# Altium project Coil_Driver.PrjPcb (part 2 of 3)

## Sheet SensorInAmp.SchDoc
size A3
Used 8 times, as channels IA1, IA2, IA3, IA4, IA5, IA6, IA7, IA8. Parts and nets are listed once, with the designators drawn on the sheet.
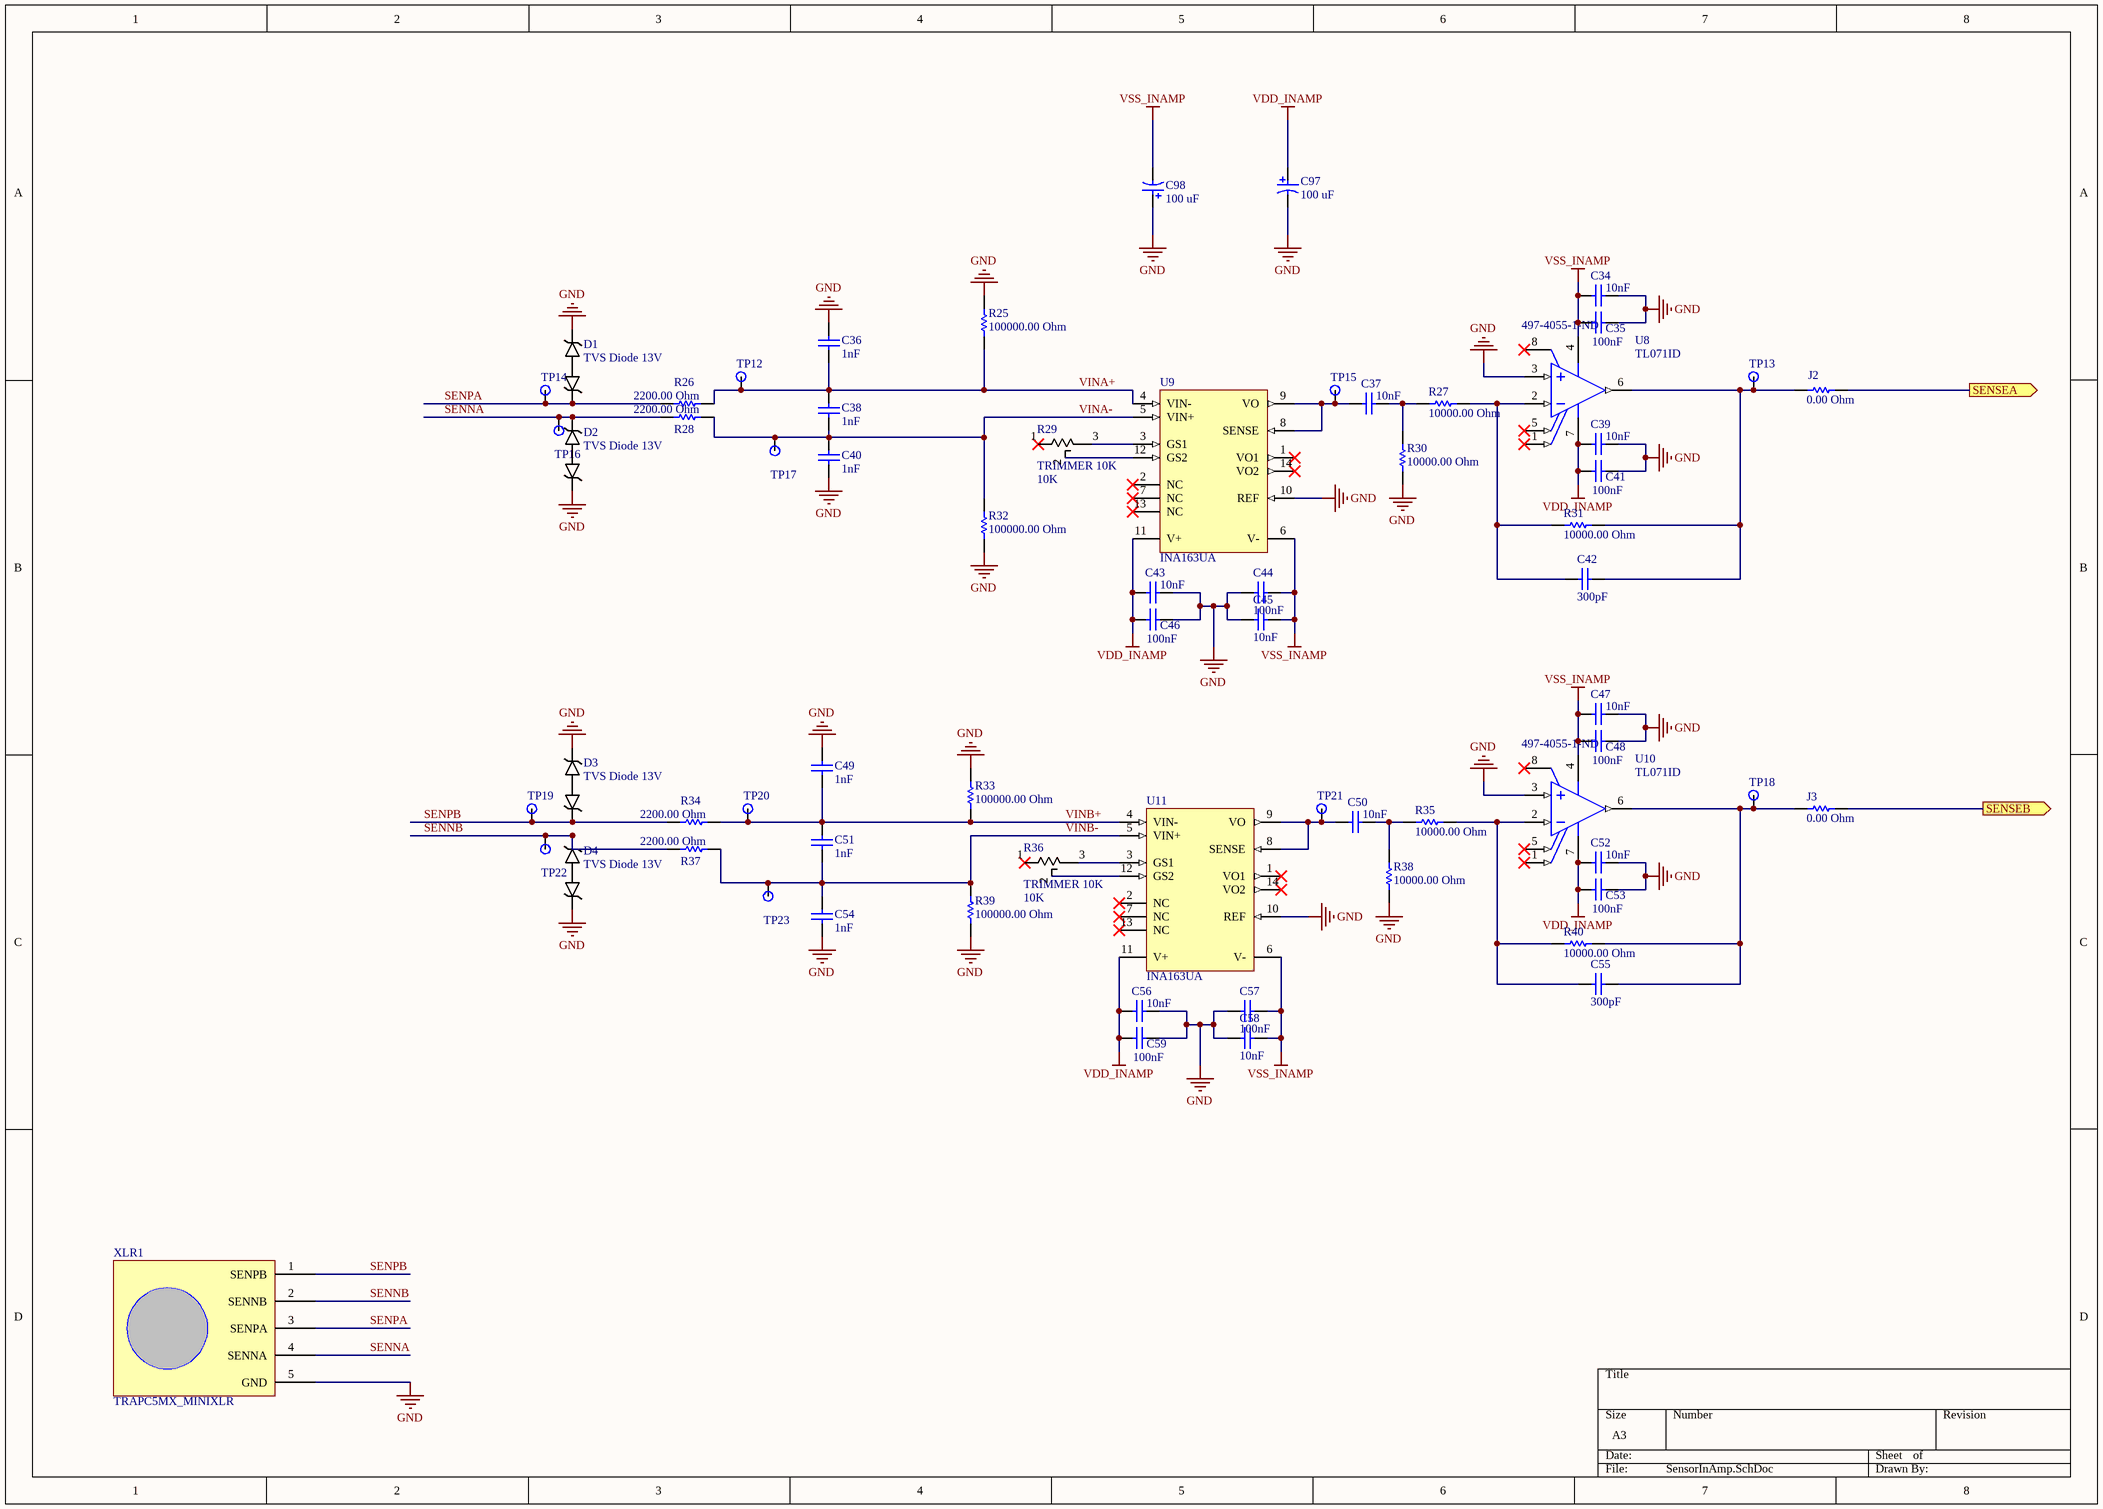
[diagram p4: SensorInAmp.SchDoc]

### Parts
C34  value 10nF  [CAPC0603(1608)100_N]  (hidden comment: CAP 10nF 25V 0603(1608))
C35  value 100nF  [CAPC0603(1608)100_M]  (hidden comment: CAP 100nF 25V 0603(1608))
C36  value 1nF  [CAPC0603(1608)100_M]  (hidden comment: CAP 1nF 25V 0603(1608))
C37  value 10nF  [CAPC0603(1608)100_N]  (hidden comment: CAP 10nF 25V 0603(1608))
C38  value 1nF  [CAPC0603(1608)100_M]  (hidden comment: CAP 1nF 25V 0603(1608))
C39  value 10nF  [CAPC0603(1608)100_N]  (hidden comment: CAP 10nF 25V 0603(1608))
C40  value 1nF  [CAPC0603(1608)100_M]  (hidden comment: CAP 1nF 25V 0603(1608))
C41  value 100nF  [CAPC0603(1608)100_M]  (hidden comment: CAP 100nF 25V 0603(1608))
C42  value 300pF  [CAPC0603(1608)100_N]  (hidden comment: CAP 300pF 25V 0603(1608))
C43  value 10nF  [CAPC0603(1608)100_N]  (hidden comment: CAP 10nF 25V 0603(1608))
C44  value 100nF  [CAPC0603(1608)100_M]  (hidden comment: CAP 100nF 25V 0603(1608))
C45  value 10nF  [CAPC0603(1608)100_N]  (hidden comment: CAP 10nF 25V 0603(1608))
C46  value 100nF  [CAPC0603(1608)100_M]  (hidden comment: CAP 100nF 25V 0603(1608))
C47  value 10nF  [CAPC0603(1608)100_N]  (hidden comment: CAP 10nF 25V 0603(1608))
C48  value 100nF  [CAPC0603(1608)100_M]  (hidden comment: CAP 100nF 25V 0603(1608))
C49  value 1nF  [CAPC0603(1608)100_M]  (hidden comment: CAP 1nF 25V 0603(1608))
C50  value 10nF  [CAPC0603(1608)100_N]  (hidden comment: CAP 10nF 25V 0603(1608))
C51  value 1nF  [CAPC0603(1608)100_M]  (hidden comment: CAP 1nF 25V 0603(1608))
C52  value 10nF  [CAPC0603(1608)100_N]  (hidden comment: CAP 10nF 25V 0603(1608))
C53  value 100nF  [CAPC0603(1608)100_M]  (hidden comment: CAP 100nF 25V 0603(1608))
C54  value 1nF  [CAPC0603(1608)100_M]  (hidden comment: CAP 1nF 25V 0603(1608))
C55  value 300pF  [CAPC0603(1608)100_N]  (hidden comment: CAP 300pF 25V 0603(1608))
C56  value 10nF  [CAPC0603(1608)100_N]  (hidden comment: CAP 10nF 25V 0603(1608))
C57  value 100nF  [CAPC0603(1608)100_M]  (hidden comment: CAP 100nF 25V 0603(1608))
C58  value 10nF  [CAPC0603(1608)100_N]  (hidden comment: CAP 10nF 25V 0603(1608))
C59  value 100nF  [CAPC0603(1608)100_M]  (hidden comment: CAP 100nF 25V 0603(1608))
C97  100 uF  [CAPPR55-250-1120X630X1220]
C98  100 uF  [CAPPR55-250-1120X630X1220]
D1  TVS Diode 13V  [CPDUR5V0R-HF]
D2  TVS Diode 13V  [CPDUR5V0R-HF]
D3  TVS Diode 13V  [CPDUR5V0R-HF]
D4  TVS Diode 13V  [CPDUR5V0R-HF]
J2  0.00 Ohm  [RESC1206(3216)_M]
J3  0.00 Ohm  [RESC1206(3216)_M]
R25  value 100000.00 Ohm  [RESC0603(1608)_N]  (hidden comment: 100K 5% 0603(1608))
R26  value 2200.00 Ohm  [RESC0603(1608)_L]  (hidden comment: 2K2 1% 0603(1608))
R27  value 10000.00 Ohm  [RESC0603(1608)_N]  (hidden comment: 10K 5% 0603(1608))
R28  value 2200.00 Ohm  [RESC0603(1608)_L]  (hidden comment: 2K2 1% 0603(1608))
R29  TRIMMER 10K  value 10K  [TRIMMER 10K]
R30  value 10000.00 Ohm  [RESC0603(1608)_N]  (hidden comment: 10K 5% 0603(1608))
R31  value 10000.00 Ohm  [RESC0603(1608)_N]  (hidden comment: 10K 5% 0603(1608))
R32  value 100000.00 Ohm  [RESC0603(1608)_N]  (hidden comment: 100K 5% 0603(1608))
R33  value 100000.00 Ohm  [RESC0603(1608)_N]  (hidden comment: 100K 5% 0603(1608))
R34  value 2200.00 Ohm  [RESC0603(1608)_L]  (hidden comment: 2K2 1% 0603(1608))
R35  value 10000.00 Ohm  [RESC0603(1608)_N]  (hidden comment: 10K 5% 0603(1608))
R36  TRIMMER 10K  value 10K  [TRIMMER 10K]
R37  value 2200.00 Ohm  [RESC0603(1608)_L]  (hidden comment: 2K2 1% 0603(1608))
R38  value 10000.00 Ohm  [RESC0603(1608)_N]  (hidden comment: 10K 5% 0603(1608))
R39  value 100000.00 Ohm  [RESC0603(1608)_N]  (hidden comment: 100K 5% 0603(1608))
R40  value 10000.00 Ohm  [RESC0603(1608)_N]  (hidden comment: 10K 5% 0603(1608))
TP12  Testpoint  [0603 PROBE PAD]  (value not drawn)
TP13  Testpoint  [0603 PROBE PAD]  (value not drawn)
TP14  Testpoint  [0603 PROBE PAD]  (value not drawn)
TP15  Testpoint  [0603 PROBE PAD]  (value not drawn)
TP16  Testpoint  [0603 PROBE PAD]  (value not drawn)
TP17  Testpoint  [0603 PROBE PAD]  (value not drawn)
TP18  Testpoint  [0603 PROBE PAD]  (value not drawn)
TP19  Testpoint  [0603 PROBE PAD]  (value not drawn)
TP20  Testpoint  [0603 PROBE PAD]  (value not drawn)
TP21  Testpoint  [0603 PROBE PAD]  (value not drawn)
TP22  Testpoint  [0603 PROBE PAD]  (value not drawn)
TP23  Testpoint  [0603 PROBE PAD]  (value not drawn)
U8  TL071ID  Supplier Part Number 1: 497-4055-1-ND  [D0008A_L]
U9  INA163UA  [D0014A_L]
U10  TL071ID  Supplier Part Number 1: 497-4055-1-ND  [D0008A_L]
U11  INA163UA  [D0014A_L]
XLR1  TRAPC5MX_MINIXLR  [MiniXLR_TRAPC5MX_5POS]

### Ports
SENSEA (out), SENSEB (out)

### Nets
GND: C34.2 C35.1 C36.2 C39.2 C40.1 C41.1 C43.2 C44.1 C45.2 C46.1 C47.2 C48.1 C49.2 C52.2 C53.1 C54.1 C56.2 C57.1 C58.2 C59.1 C97.2 C98.1 D1.2 D2.1 D3.2 D4.1 R25.1 R30.2 R32.2 R33.1 R38.2 R39.2 U8.3(IN+) U9.10(REF) U10.3(IN+) U11.10(REF) XLR1.5(GND)
VDD_INAMP: C39.1 C41.2 C43.1 C46.2 C52.1 C53.2 C56.1 C59.2 C97.1 U8.7(VCC+) U9.11(V+) U10.7(VCC+) U11.11(V+)
VSS_INAMP: C34.1 C35.2 C44.2 C45.1 C47.1 C48.2 C57.2 C58.1 C98.2 U8.4(VCC-) U9.6(V-) U10.4(VCC-) U11.6(V-)
SENNA: D2.2 R28.2 TP16.0 XLR1.4(SENNA)
SENNB: D4.2 R37.2 TP22.0 XLR1.2(SENNB)
SENPA: D1.1 R26.2 TP14.0 XLR1.3(SENPA)
SENPB: D3.1 R34.2 TP19.0 XLR1.1(SENPB)
SENSEA: J2.2 ; port SENSEA
SENSEB: J3.2 ; port SENSEB
VINA+: C36.1 C38.2 R25.2 R26.1 TP12.0 U9.4(VIN-)
VINA-: C38.1 C40.2 R28.1 R32.1 TP17.0 U9.5(VIN+)
VINB+: C49.1 C51.2 R33.2 R34.1 TP20.0 U11.4(VIN-)
VINB-: C51.1 C54.2 R37.1 R39.1 TP23.0 U11.5(VIN+)
NetC37_1: C37.1 TP15.0 U9.8(SENSE) U9.9(VO)
NetC37_2: C37.2 R27.2 R30.1
NetC42_1: C42.1 J2.1 R31.1 TP13.0 U8.6(OUT)
NetC42_2: C42.2 R27.1 R31.2 U8.2(IN-)
NetC50_1: C50.1 TP21.0 U11.8(SENSE) U11.9(VO)
NetC50_2: C50.2 R35.2 R38.1
NetC55_1: C55.1 J3.1 R40.1 TP18.0 U10.6(OUT)
NetC55_2: C55.2 R35.1 R40.2 U10.2(IN-)
NetR29_2: R29.2 U9.12(GS2)
NetR29_3: R29.3 U9.3(GS1)
NetR36_2: R36.2 U11.12(GS2)
NetR36_3: R36.3 U11.3(GS1)

Not connected (* = marked no-connect by the designer): R29 1*; R36 1*; U8 1(OFFSET_N1)* 5(OFFSET_N2)* 8(NC)*; U9 1(VO1)* 2(NC)* 7(NC)* 13(NC)* 14(VO2)*; U10 1(OFFSET_N1)* 5(OFFSET_N2)* 8(NC)*; U11 1(VO1)* 2(NC)* 7(NC)* 13(NC)* 14(VO2)*

### Channels
IA1: designators end in _IA1; ports SENSEA=SENSEA1 SENSEB=SENSEB1
IA2: designators end in _IA2; ports SENSEA=SENSEA2 SENSEB=SENSEB2
IA3: designators end in _IA3; ports SENSEA=SENSEA3 SENSEB=SENSEB3
IA4: designators end in _IA4; ports SENSEA=SENSEA4 SENSEB=SENSEB4
IA5: designators end in _IA5; ports SENSEA=SENSEA5 SENSEB=SENSEB5
IA6: designators end in _IA6; ports SENSEA=SENSEA6 SENSEB=SENSEB6
IA7: designators end in _IA7; ports SENSEA=SENSEA7 SENSEB=SENSEB7
IA8: designators end in _IA8; ports SENSEA=SENSEA8 SENSEB=SENSEB8

### Library data of the parts
C34 C37 C39 C43 C45 C47 C50 C52 C56 C58 = CMP-1035-02317-1: CAP 10nF 25V ±10% 0603 (1608 Metric) Thickness 1mm SMD; Tolerance: Â±10%; Case-Metric: 1608; Case-EIA: 0603; Max Thickness: 1 mm; Rated Voltage: 25 V; Technology: SMT; OrderURL: http://www.digikey.ie/product-detail/en/yageo/CC0603KRX7R8BB103/311-1360-1-ND/2103144; Supplier 1: Digi-Key; Supplier Part Number: 311-1360-1-ND; Supplier Part Number 1: 311-1360-1-ND
C35 C41 C44 C46 C48 C53 C57 C59 = CMP-1035-02588-1: CAP 100nF 25V ±10% 0603 (1608 Metric) Thickness 1mm SMD; Case-Metric: 1608; Case-EIA: 0603; Tolerance: Â±10%; Max Thickness: 1 mm; Technology: SMT; Rated Voltage: 25 V; OrderURL: http://www.digikey.ie/product-detail/en/yageo/CC0603KRX7R8BB104/311-1341-1-ND/2103125; Supplier 1: Digi-Key; Supplier Part Number 1: 311-1341-1-ND
C36 C38 C40 C49 C51 C54 = CMP-1035-01883-1: CAP 1nF 25V ±5% 0603 (1608 Metric) Thickness 1mm SMD; Case-EIA: 0603; Tolerance: Â±5%; Case-Metric: 1608; Technology: SMT; Rated Voltage: 25 V; Max Thickness: 1 mm
C42 C55 = CMP-1035-01546-1: CAP 300pF 25V ±10% 0603 (1608 Metric) Thickness 1mm SMD; Tolerance: Â±10%; Case-EIA: 0603; Case-Metric: 1608; Rated Voltage: 25 V; Technology: SMT; Max Thickness: 1 mm
C97 C98 = CMP-1665-00015-4: Aluminum Electrolytic Capacitor (Radial Lead Type), 100 uF, 35 V, -40 to 85 degC, 2-Pin THD, RoHS, Bulk; Manufacturer: Panasonic; Voltage Rating: 35 V; PackageReference: Radial; ComponentLink2URL: http://industrial.panasonic.com/cdbs/www-data/pdf/RDF0000/ABA0000C1047.pdf; DatasheetVersion: 03/2016; REACH SVHC: No SVHC; Mounting Technology: Through Hole; ComponentLink2Description: Datasheet; Packaging: Bulk; Lead Pitch: 2.5 mm; Height: 11.2 mm; Pins: 2; RoHSCompliant: true; Mount: Through Hole; Package Quantity: 200; Min Operating Temperature: -40 degC; Max Operating Temperature: 85 degC; PackageDescription: 2-Pin Through Hole Device, Dia 6.3 mm, Body Length 11.2 mm; ComponentLink1Description: Manufacturer URL; Length: 11.2 mm; ComponentLink1URL: http://www.panasonic.com/
D1-D4 = CPDUR5V0R-HF: TVS DIODE 5VWM 13VC SOD-523F; Manufacturer: Comchip Technology; Type: Zener; Voltage - Reverse Standoff (Typ): 5V (Max); Voltage - Breakdown (Min): 5.6V; Current - Peak Pulse (10/1000µs): 12A (8/20µs); Power Line Protection: No; Capacitance @ Frequency: 20pF @ 1MHz; Value: 1K; Published: 8-Jun-2000; LatestRevisionDate: 29-May-2009; LatestRevisionNote: IPC-7351 Footprint Added.; PackageReference: J1-0603; Publisher: Altium Limited; PackageDescription: Chip Resistor; Manufacturer Part Number: CPDUR5V0R-HF; RoHS: RoHS Compliant; Category: Circuit Protection; Packaging: Cut Tape (CT); Part Status: Active; Voltage - Clamping (Max) @ Ipp: 13V; Power - Peak Pulse: -; Applications: General Purpose; Operating Temperature: -40°C ~ 150°C (TJ); Mounting Type: Surface Mount; Package / Case: SC-79, SOD-523; Supplier Device Package: 0603/SOD-523F; ComponentLink1URL: http://www.comchiptech.com/cms/UserFiles/CPDUR5V0R-HF-Rev%20B339379.pdf; ComponentLink1Description: http://www.comchiptech.com/cms/UserFiles/CPDUR5V0R-HF-Rev%20B339379.pdf; Supplier 1: Digi-Key; Supplier Part Number 1: 641-1526-1-ND; Stock 1: 6593; Pricing 1: 1=0.38, 10=0.271, 25=0.2112, 100=0.1597, 250=0.113, 500=0.09044, 1000=0.06933 (EUR)
J2 J3 = CMP-1014-00001-1: Jumper 1206 (3216 Metric); Tolerance: None; Case-EIA: 1206; Case-Metric: 3216; Technology: SMT; Power: None; Value: 0.00 Ohm; OrderURL: http://www.digikey.ie/product-detail/en/yageo/RC0603JR-070RL/311-0.0GRCT-ND/729622; Supplier 1: Digi-Key; Supplier Part Number 1: 311-0.0GRCT-ND
R25 R32 R33 R39 = CMP-1012-00122-1: 100K 0.1W 5% 0603 (1608 Metric)  SMD; Case-EIA: 0603; Case-Metric: 1608; Tolerance: 5 %; Power: 0.1 W; Technology: SMT; OrderURL: http://www.digikey.ie/product-detail/en/yageo/RC0603JR-07100KL/311-100KGRCT-ND/729645; Supplier Part Number 1: 311-100KGRCT-ND; Supplier 1: Digi-Key
R26 R28 R34 R37 = CMP-1012-00546-1: 2K2 0.1W 1% 0603 (1608 Metric)  SMD; Case-EIA: 0603; Case-Metric: 1608; Tolerance: 1 %; Power: 0.1 W; Technology: SMT
R27 R30 R31 R35 R38 R40 = CMP-1012-00098-1: 10K 0.1W 5% 0603 (1608 Metric)  SMD; Case-EIA: 0603; Case-Metric: 1608; Technology: SMT; Tolerance: 5 %; Power: 0.1 W; OrderURL: http://www.digikey.ie/product-detail/en/yageo/RC0603JR-0710KL/311-10KGRCT-ND/729647; Supplier 1: Digi-Key; Supplier Part Number 1: 311-10KGRCT-ND
R29 R36 = TRIMMER 10K: TRIMMER 10K OHM 0.5W TH; Manufacturer: TE Connectivity Passive Product; Manufacturer Part Number: 1-1623849-0; Power (Watts): 0.5W, 1/2W; Tolerance: ±10%; Temperature Coefficient: ±100ppm/°C; Number of Turns: 25; Adjustment Type: Top Adjustment; Resistive Material: Cermet; Published: 8-Jun-2000; LatestRevisionDate: 29-May-2009; LatestRevisionNote: IPC-7351 Footprint Added.; PackageReference: J1-0603; Publisher: Altium Limited; PackageDescription: Chip Resistor; RoHS: RoHS Compliant; Category: Potentiometers, Variable Resistors; Packaging: Bulk; Part Status: Active; Resistance (Ohms): 10k; Mounting Type: Through Hole; Termination Style: PC Pins; Size / Dimension: Rectangular - 0.374" x 0.185" Face x 0.394" H (9.50mm x 4.70mm x 10.00mm); ComponentLink1URL: http://www.te.com/commerce/DocumentDelivery/DDEController?Action=srchrtrv&DocNm=1623849&DocType=Customer+Drawing&DocLang=English; ComponentLink1Description: http://www.te.com/commerce/DocumentDelivery/DDEController?Action=srchrtrv&DocNm=1623849&DocType=Customer+Drawing&DocLang=English; Supplier 1: Digi-Key; Supplier Part Number 1: A105870-ND; Stock 1: 5809; Pricing 1: 1=0.89, 10=0.786, 25=0.7076, 50=0.6816, 100=0.6554, 250=0.61608, 500=0.5243, 1000=0.48499, 5000=0.39848 (EUR)
TP12-TP23 = Testpoint: 0.063" x 0.031" x 0.045" (1.60mm x 0.80mm x 1.15mm); OrderURL: http://www.digikey.ie/product-detail/en/te-connectivity-amp-connectors/RCU-0C/A106145CT-ND/3477802; Value: *; Width: 0.8; Height: 1.15mm; Length: 1.60mm; Supplier Part Number 1: A106145CT-ND; Supplier 1: Digi-Key
U8 U10 = CMP-0017-00492-2: Low-Noise JFET-Input General-Purpose Operational Amplifier, 7 to 36 V, -40 to 85 degC, 8-pin SOIC (D8), Green (RoHS & no Sb/Br); Manufacturer: Texas Instruments; Manufacturer Part Number: TL071CDT; Total Supply Voltage(Max)(+5V is 5, +/-5V is 10): 36; Rating: Military; GBW(Typ)(MHz): 3; CMRR(Min)(dB): 75; Number of Channels: 1; Vn at 1kHz(Typ)(nV/rtHz): 18; Total Supply Voltage(Min)(+5V is 5, +/-5V is 10): 7; IIB(Max)(pA): 200; Slew Rate(Typ)(V/us): 13; Iq per channel(Max)(mA): 2.5; Vio (25C)(Max)(mV): 6; Sub Family: General Purpose Amplifier, High Supply Voltage Amplifier (>=30V); Amplifier Type: J-FET; Slew Rate: 16 V/µs; Gain Bandwidth Product: 4MHz; Current - Input Bias: 20pA; Voltage - Input Offset: 3mV; Current - Supply: 1.4mA; Current - Output / Channel: 40mA; Voltage - Supply, Single/Dual (±): 6 V ~ 36 V, ±3 V ~ 18 V; PackageVersion: 4040047-3/M, 06/2011; ComponentLink2Description: Datasheet; PackageDescription: 8-Pin Plastic Small Outline, Body 4.9 x 3.9 mm, Pitch 1.27 mm; Mounting Technology: Surface Mount; Eco-Plan: Green (RoHS & no Sb/Br); DatasheetVersion: SLOS080J; PackageReference: D0008A; ComponentLink3Description: Package Specification; PartNumber: TL071ID; ComponentLink2URL: http://www.ti.com/lit/ds/symlink/tl071.pdf; ComponentLink3URL: http://www.ti.com/litv/pdf/msoi002j; Offset Drift(Typ)(uV/C): 18; ComponentLink1Description: Manufacturer URL; ComponentLink1URL: http://www.ti.com/; Code_JEDEC: MS-012; OrderURL: http://www.digikey.ie/product-detail/en/stmicroelectronics/TL071CDT/497-4055-1-ND/720975; Supplier 1: Digi-Key; RoHS: RoHS Compliant; Category: Integrated Circuits (ICs); Stock 1: 10528; Pricing 1: 1=0.38, 10=0.328, 100=0.245, 500=0.1925, 1000=0.14876 (EUR); Packaging: Cut Tape (CT); Part Status: Active; Number of Circuits: 1; Output Type: -; -3db Bandwidth: -; Operating Temperature: 0°C ~ 70°C; Mounting Type: Surface Mount; Package / Case: 8-SOIC (0.154", 3.90mm Width); Supplier Device Package: 8-SO; ComponentLink4URL: http://www.st.com/content/ccc/resource/technical/document/datasheet/1b/33/43/ff/18/5f/40/30/CD00000488.pdf/files/CD00000488.pdf/jcr:content/translations/en.CD00000488.pdf; ComponentLink4Description: http://www.st.com/content/ccc/resource/technical/document/datasheet/1b/33/43/ff/18/5f/40/30/CD00000488.pdf/files/CD00000488.pdf/jcr:content/translations/en.CD00000488.pdf
U9 U11 = CMP-0944-00013-2: Low-Noise Low-Distortion Instrumentation Amplifier, -40 to 125 degC, 14-pin SOIC (D14), Green (RoHS & no Sb/Br); Manufacturer: Texas Instruments; Input Offset (+/-)(Max)(uV): 250; Gain(V/V): 1 to 10000; Quiescent Current (+/-)(Typ)(mA): 10; Input Bias Current (+/-)(Max)(nA): 12000; SubFamily: Single Supply; Noise at 1kHz(Typ)(nV/rt(Hz)): 1; Vs(Min)(V): 9; CMRR(Min)(dB): 100; Vs(Max)(V): 36; Non-Linearity (+/-)(Max)(%): 0.0006; ComponentLink3URL: http://www.ti.com/lit/ml/mpds177g/mpds177g.pdf; ComponentLink1Description: Manufacturer URL; Code_JEDEC: MS-012; PackageReference: D0014A; Eco-Plan: Green (RoHS & no Sb/Br); ComponentLink2URL: http://www.ti.com/general/docs/lit/getliterature.tsp?genericPartNumber=INA163&fileType=pdf; PackageVersion: 4040047-5/M, 06/2011; PackageDescription: 14-Pin Plastic Small Outline, Body 8.65 x 3.9 mm, Pitch 1.27 mm; PartNumber: INA163UA; DatasheetVersion: SBOS177D; ComponentLink2Description: Datasheet; ComponentLink3Description: Package Specification; ComponentLink1URL: http://www.ti.com/; Mounting Technology: Surface Mount
XLR1 = TRAPC5MX_MINIXLR: CONN RCPT 5POS R/A MALE T/H; Manufacturer: Switchcraft Inc.; Connector Type: Receptacle, Male Pins; Number of Positions: 5; Current Rating: 5A; Voltage - Rated: 125VAC; Published: 8-Jun-2000; LatestRevisionDate: 29-May-2009; LatestRevisionNote: IPC-7351 Footprint Added.; PackageReference: J1-0603; Publisher: Altium Limited; PackageDescription: Chip Resistor; Manufacturer Part Number: TRAPC5MX; RoHS: RoHS Compliant; Category: Connectors, Interconnects; Packaging: Bulk; Part Status: Active; Shell Size - Insert: Mini XLR; Shell Size, MIL: -; Mounting Type: Through Hole, Right Angle; Termination: Solder; Fastening Type: Threaded; Orientation: Keyed; Ingress Protection: -; Shell Material, Finish: Thermoplastic; Contact Finish: Tin; Features: Board Guide; Contact Finish Thickness: -; Operating Temperature: -55°C ~ 85°C; ComponentLink1URL: http://www.switchcraft.com/Drawings/TRAPC_X-TRASM_X_SERIES_CD.PDF; ComponentLink1Description: http://www.switchcraft.com/Drawings/TRAPC_X-TRASM_X_SERIES_CD.PDF; Supplier 1: Digi-Key; Supplier Part Number 1: SC2056-ND; Stock 1: 291; Pricing 1: 1=6.25, 10=5.041, 25=4.602, 50=4.3826, 100=4.1636, 250=3.80444 (EUR)

## Sheet EmitterConnector.SchDoc
size A4
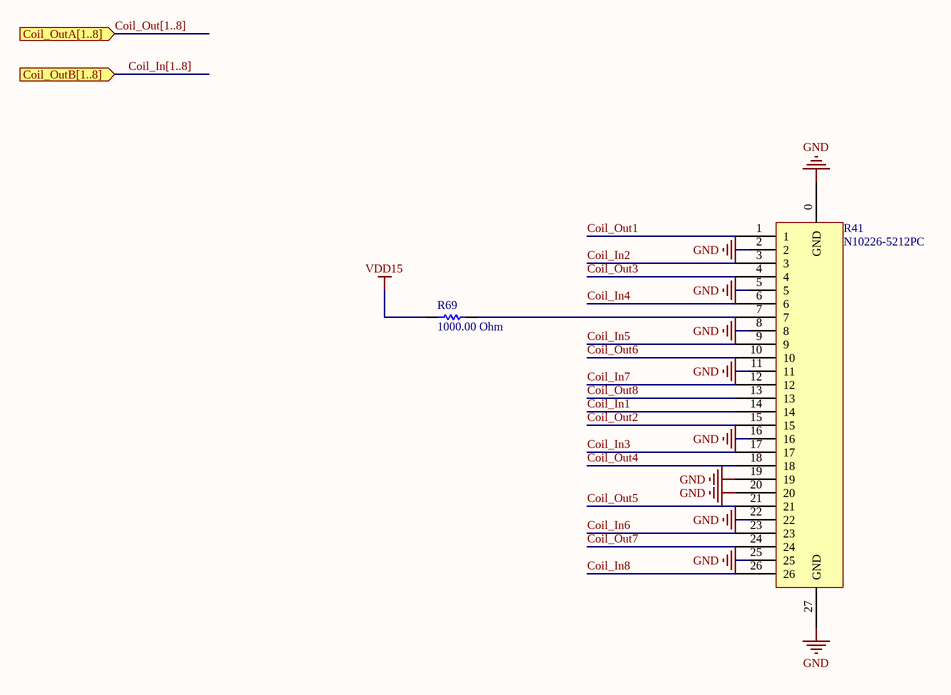
[diagram p5: EmitterConnector.SchDoc]

### Parts
R41  N10226-5212PC  [CONN MINI-D 26POS R/A RECPT]
R69  value 1000.00 Ohm  [RESC0603(1608)_L]  (hidden comment: 1K 5% 0603(1608))

### Ports
Coil_OutA[1..8] (in), Coil_OutB[1..8] (in)

### Nets
GND: R41.0(GND) R41.2 R41.5 R41.8 R41.11 R41.16 R41.19 R41.20 R41.22 R41.25 R41.27(GND)
VDD15: R69.1
Coil_In1: R41.14
Coil_In2: R41.3
Coil_In3: R41.17
Coil_In4: R41.6
Coil_In5: R41.9
Coil_In6: R41.23
Coil_In7: R41.12
Coil_In8: R41.26
Coil_Out1: R41.1
Coil_Out2: R41.15
Coil_Out3: R41.4
Coil_Out4: R41.18
Coil_Out5: R41.21
Coil_Out6: R41.10
Coil_Out7: R41.24
Coil_Out8: R41.13
NetR41_7: R41.7 R69.2

### Buses and harness runs
bus Coil_In[1..8] = port Coil_OutB[1..8]
bus Coil_Out[1..8] = port Coil_OutA[1..8]

### Library data of the parts
R41 = N10226-5212PC: CONN MINI-D 26POS R/A RECPT; Manufacturer: 3M; Connector Style: Outer Shroud Contacts; Connector Type: Receptacle; Number of Positions: 26; Flange Feature: Insert, Threaded (M2.5); Latchblocks; Published: 8-Jun-2000; LatestRevisionDate: 29-May-2009; LatestRevisionNote: IPC-7351 Footprint Added.; PackageReference: J1-0603; Publisher: Altium Limited; PackageDescription: Chip Resistor; Manufacturer Part Number: N10226-5212PC; RoHS: RoHS Compliant; Category: Connectors, Interconnects; Part Status: Active; Number of Rows: 2; Mounting Type: Panel Mount, Through Hole, Right Angle; Termination: Solder; Type: -; Features: Shielded; Contact Finish: Gold; Contact Finish Thickness: 30µin (0.76µm); ComponentLink1URL: http://multimedia.3m.com/mws/media/22325O/3mtm-mini-d-ribbonmdr-050-bm-thru-hole-ra-shielded-ts0531.pdf; ComponentLink1Description: http://multimedia.3m.com/mws/media/22325O/3mtm-mini-d-ribbonmdr-050-bm-thru-hole-ra-shielded-ts0531.pdf; Supplier 1: Digi-Key; Supplier Part Number 1: N10226-5212PC-ND; Stock 1: 782; Pricing 1: 1=7.63, 10=7.291, 25=6.6284, 50=6.2972, 100=6.1314, 250=5.4686, 500=5.13714, 1000=4.54056, 2500=4.30856 (EUR)
R69 = CMP-1012-00074-1: 1K 0.1W 5% 0603 (1608 Metric)  SMD; Case-EIA: 0603; Case-Metric: 1608; Technology: SMT; Tolerance: 5 %; Power: 0.1 W; OrderURL: http://www.digikey.ie/product-detail/en/yageo/RC0603JR-071KL/311-1.0KGRCT-ND/729624; Supplier 1: Digi-Key; Supplier Part Number 1: 311-1.0KGRCT-ND

## Sheet DAQ.SchDoc
size A3
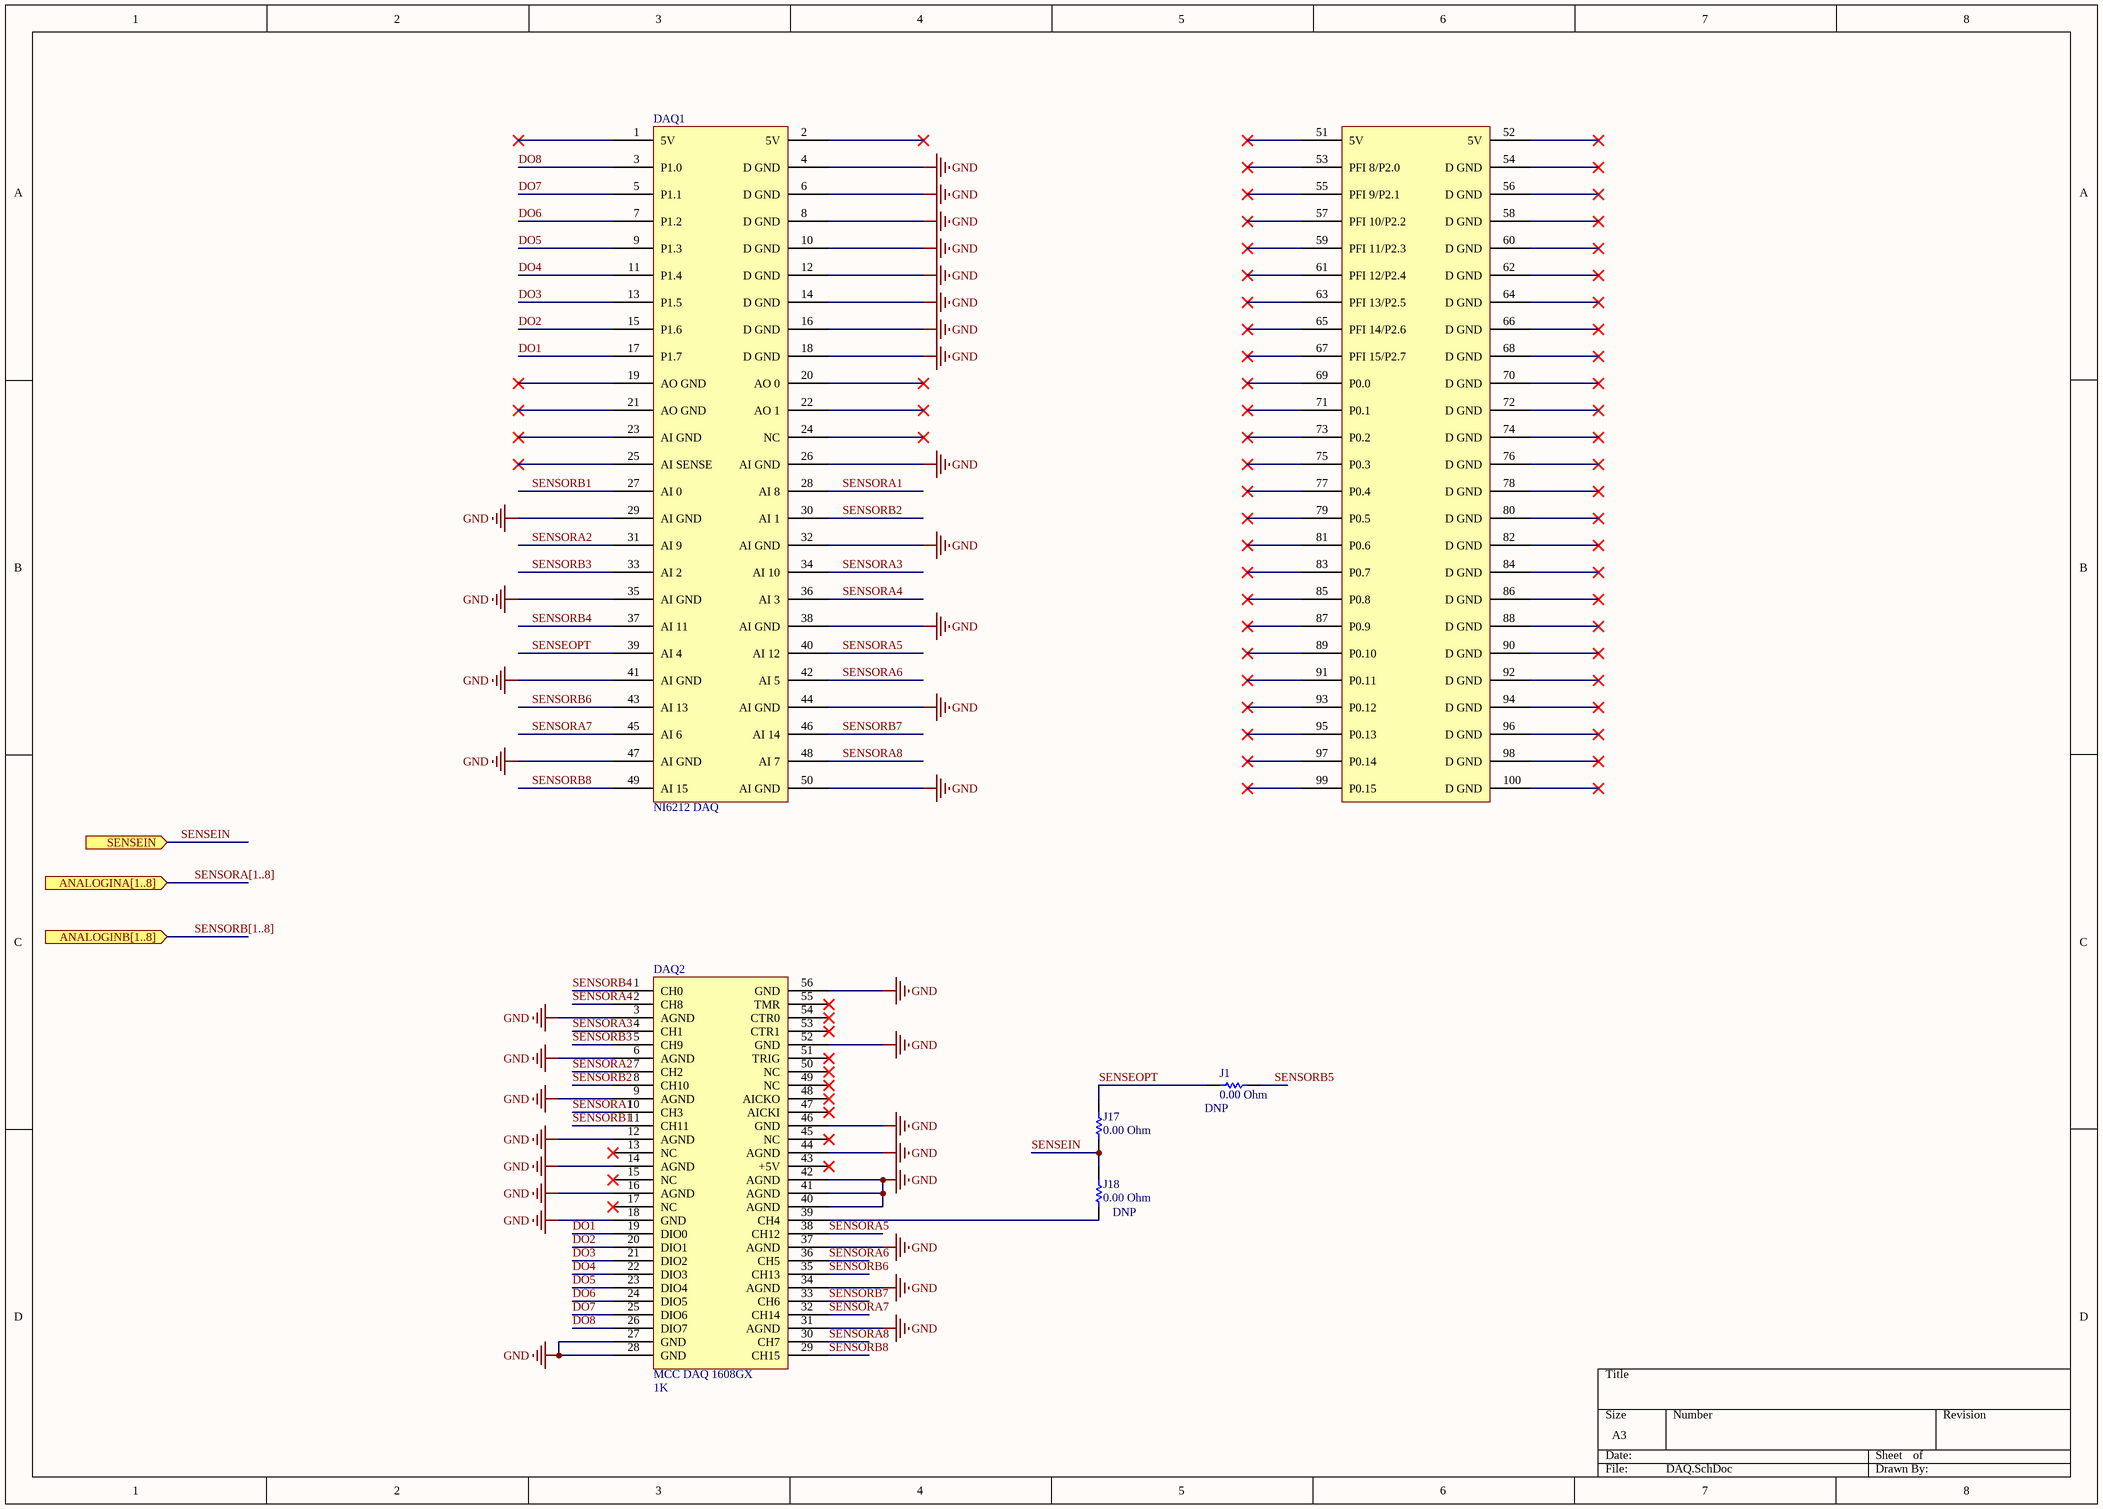
[diagram p6: DAQ.SchDoc]

### Parts
DAQ1  NI6212 DAQ  [NIDAQ6212]
DAQ2  MCC DAQ 1608GX  value 1K  [DAQ_MCC]
J1  0.00 Ohm  OPTION: DNP  [RESC1206(3216)_M]
J17  0.00 Ohm  [RESC1206(3216)_M]
J18  0.00 Ohm  OPTION: DNP  [RESC1206(3216)_M]

### Ports
ANALOGINA[1..8] (in), ANALOGINB[1..8] (in), SENSEIN (in)

### Nets
GND: DAQ1.4(D_GND) DAQ1.6(D_GND) DAQ1.8(D_GND) DAQ1.10(D_GND) DAQ1.12(D_GND) DAQ1.14(D_GND) DAQ1.16(D_GND) DAQ1.18(D_GND) DAQ1.26(AI_GND) DAQ1.29(AI_GND) DAQ1.32(AI_GND) DAQ1.35(AI_GND) DAQ1.38(AI_GND) DAQ1.41(AI_GND) DAQ1.44(AI_GND) DAQ1.47(AI_GND) DAQ1.50(AI_GND) DAQ2.3(AGND) DAQ2.6(AGND) DAQ2.9(AGND) DAQ2.12(AGND) DAQ2.14(AGND) DAQ2.16(AGND) DAQ2.18(GND) DAQ2.27(GND) DAQ2.28(GND) DAQ2.31(AGND) DAQ2.34(AGND) DAQ2.37(AGND) DAQ2.40(AGND) DAQ2.41(AGND) DAQ2.42(AGND) DAQ2.44(AGND) DAQ2.46(GND) DAQ2.52(GND) DAQ2.56(GND)
DO1: DAQ1.17(P1.7) DAQ2.19(DIO0)
DO2: DAQ1.15(P1.6) DAQ2.20(DIO1)
DO3: DAQ1.13(P1.5) DAQ2.21(DIO2)
DO4: DAQ1.11(P1.4) DAQ2.22(DIO3)
DO5: DAQ1.9(P1.3) DAQ2.23(DIO4)
DO6: DAQ1.7(P1.2) DAQ2.24(DIO5)
DO7: DAQ1.5(P1.1) DAQ2.25(DIO6)
DO8: DAQ1.3(P1.0) DAQ2.26(DIO7)
SENSEIN: J17.1 J18.2 ; port SENSEIN
SENSEOPT: DAQ1.39(AI_4) J1.2 J17.2
SENSORA1: DAQ1.28(AI_8) DAQ2.10(CH3)  [project net SENSEA1]
SENSORA2: DAQ1.31(AI_9) DAQ2.7(CH2)  [project net SENSEA2]
SENSORA3: DAQ1.34(AI_10) DAQ2.4(CH1)  [project net SENSEA3]
SENSORA4: DAQ1.36(AI_3) DAQ2.2(CH8)  [project net SENSEA4]
SENSORA5: DAQ1.40(AI_12) DAQ2.38(CH12)  [project net SENSEA5]
SENSORA6: DAQ1.42(AI_5) DAQ2.36(CH5)  [project net SENSEA6]
SENSORA7: DAQ1.45(AI_6) DAQ2.32(CH14)  [project net SENSEA7]
SENSORA8: DAQ1.48(AI_7) DAQ2.30(CH7)  [project net SENSEA8]
SENSORB1: DAQ1.27(AI_0) DAQ2.11(CH11)  [project net SENSEB1]
SENSORB2: DAQ1.30(AI_1) DAQ2.8(CH10)  [project net SENSEB2]
SENSORB3: DAQ1.33(AI_2) DAQ2.5(CH9)  [project net SENSEB3]
SENSORB4: DAQ1.37(AI_11) DAQ2.1(CH0)  [project net SENSEB4]
SENSORB5: J1.1  [project net SENSEB5]
SENSORB6: DAQ1.43(AI_13) DAQ2.35(CH13)  [project net SENSEB6]
SENSORB7: DAQ1.46(AI_14) DAQ2.33(CH6)  [project net SENSEB7]
SENSORB8: DAQ1.49(AI_15) DAQ2.29(CH15)  [project net SENSEB8]
NetDAQ2_39: DAQ2.39(CH4) J18.1

Not connected (* = marked no-connect by the designer): DAQ1 1(5V)* 2(5V)* 19(AO_GND)* 20(AO_0)* 21(AO_GND)* 22(AO_1)* 23(AI_GND)* 24(NC)* 25(AI_SENSE)* 51(5V)* 52(5V)* 53(PFI_8/P2.0)* 54(D_GND)* 55(PFI_9/P2.1)* 56(D_GND)* 57(PFI_10/P2.2)* 58(D_GND)* 59(PFI_11/P2.3)* 60(D_GND)* 61(PFI_12/P2.4)* 62(D_GND)* 63(PFI_13/P2.5)* 64(D_GND)* 65(PFI_14/P2.6)* 66(D_GND)* 67(PFI_15/P2.7)* 68(D_GND)* 69(P0.0)* 70(D_GND)* 71(P0.1)* 72(D_GND)* 73(P0.2)* 74(D_GND)* 75(P0.3)* 76(D_GND)* 77(P0.4)* 78(D_GND)* 79(P0.5)* 80(D_GND)* 81(P0.6)* 82(D_GND)* 83(P0.7)* 84(D_GND)* 85(P0.8)* 86(D_GND)* 87(P0.9)* 88(D_GND)* 89(P0.10)* 90(D_GND)* 91(P0.11)* 92(D_GND)* 93(P0.12)* 94(D_GND)* 95(P0.13)* 96(D_GND)* 97(P0.14)* 98(D_GND)* 99(P0.15)* 100(D_GND)*; DAQ2 13(NC)* 15(NC)* 17(NC)* 43(+5V)* 45(NC)* 47(AICKI)* 48(AICKO)* 49(NC)* 50(NC)* 51(TRIG)* 53(CTR1)* 54(CTR0)* 55(TMR)*

### Buses and harness runs
bus SENSORA[1..8] = port ANALOGINA[1..8]
bus SENSORB[1..8] = port ANALOGINB[1..8]

### Library data of the parts
DAQ1 = NI6212: DAQ Unit; Published: 8-Jun-2000; Publisher: National Instruments
DAQ2 = MCC USB-1608GX_OEM: Published: 8-Jun-2000; LatestRevisionDate: 29-May-2009; LatestRevisionNote: IPC-7351 Footprint Added.; PackageReference: J1-0603; Publisher: Altium Limited; PackageDescription: Chip Resistor
J1 J17 J18 = CMP-1014-00001-1: as J2 on sheet SensorInAmp; Technology: SMT; Power: None; Value: 0.00 Ohm; OrderURL: http://www.digikey.ie/product-detail/en/yageo/RC0603JR-070RL/311-0.0GRCT-ND/729622; Supplier 1: Digi-Key; Supplier Part Number 1: 311-0.0GRCT-ND

## Sheet PowerIn.SchDoc
size A4
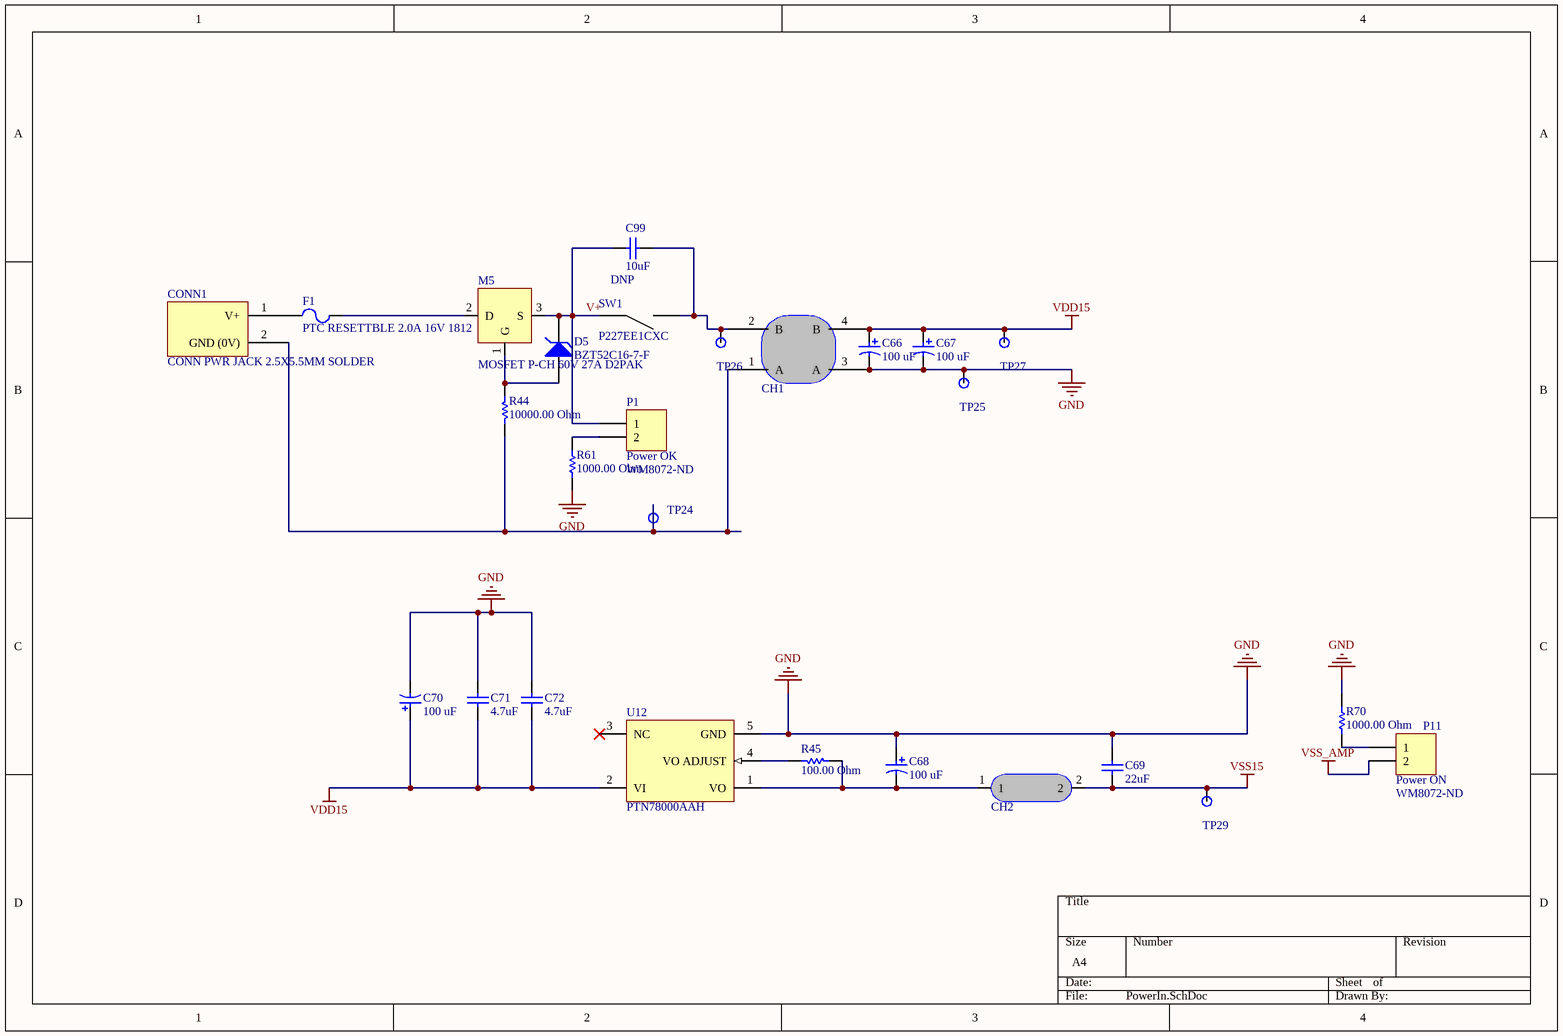
[diagram p7: PowerIn.SchDoc]

### Parts
C66  100 uF  [CAPPR55-250-1120X630X1220]
C67  100 uF  [CAPPR55-250-1120X630X1220]
C68  100 uF  [CAPPR55-250-1120X630X1220]
C69  value 22uF  [CAPC1206(3216)190_M]  (hidden comment: CAP 22uF 25V 1206(3216))
C70  100 uF  [CAPPR55-250-1120X630X1220]
C71  value 4.7uF  [CAPC0805(2012)145_L]  (hidden comment: CAP 4.7uF 25V 0805(2012))
C72  value 4.7uF  [CAPC0805(2012)145_L]  (hidden comment: CAP 4.7uF 25V 0805(2012))
C99  value 10uF  OPTION: DNP  [CAPC1206(3216)190_L]  (hidden comment: CAP 10uF 25V 1206(3216))
CH1  10uH 2.4A COMMON CHOKE  [10uH 2.4A COMMON CHOKE]  (value not drawn)
CH2  FIXED IND 10UH 5A 25 MOHM SMD  [FIXED IND 10UH 5A 190 MOHM SMD]  (value not drawn)
CONN1  CONN PWR JACK 2.5X5.5MM SOLDER  [CONN PWR JACK 2.5X5.5MM SOLDER]
D5  BZT52C16-7-F  [DIOD-SOD123-2_V]
F1  PTC RESETTBLE 2.0A 16V 1812  [TC RESETTBLE 2.0A 16V 1812]
M5  MOSFET P-CH 60V 27A D2PAK  [DPAK228P1525X483-3N]
P1  Power OK  Supplier Part Number 1: WM8072-ND  [HDR1X2]
P11  Power ON  Supplier Part Number 1: WM8072-ND  [HDR1X2]
R44  value 10000.00 Ohm  [RESC0603(1608)_N]  (hidden comment: 10K 5% 0603(1608))
R45  value 100.00 Ohm  [RESC0603(1608)_M]  (hidden comment: 100R 1% 0603(1608))
R61  value 1000.00 Ohm  [RESC0603(1608)_L]  (hidden comment: 1K 5% 0603(1608))
R70  value 1000.00 Ohm  [RESC0603(1608)_L]  (hidden comment: 1K 5% 0603(1608))
SW1  P227EE1CXC  [P227EE1CXC]
TP24  Testpoint  [0603 PROBE PAD]  (value not drawn)
TP25  Testpoint  [0603 PROBE PAD]  (value not drawn)
TP26  Testpoint  [0603 PROBE PAD]  (value not drawn)
TP27  Testpoint  [0603 PROBE PAD]  (value not drawn)
TP29  Testpoint  [0603 PROBE PAD]  (value not drawn)
U12  PTN78000AAH  [EUS0005A]

### Nets
GND: C66.2 C67.2 C68.1 C69.2 C70.2 C71.1 C72.1 CH1.3(A) R61.2 R70.1 TP25.0 U12.5(GND)
VDD15: C66.1 C67.1 C70.1 C71.2 C72.2 CH1.4(B) TP27.0 U12.2(VI)
VSS15: C69.1 CH2.2 TP29.0
VSS_AMP: P11.2
V+: C99.2 D5.2(K) M5.3(S) P1.1 SW1.1
NetC68_2: C68.2 CH2.1 R45.1 U12.1(VO)
NetC99_1: C99.1 CH1.2(B) SW1.2 TP26.0
NetCH1_1: CH1.1(A) CONN1.2(GND_(0V)) R44.1 TP24.0
NetCONN1_1: CONN1.1(V+) F1.1
NetD5_1: D5.1(A) M5.1(G) R44.2
NetF1_2: F1.2 M5.2(D)
NetP1_2: P1.2 R61.1
NetP11_1: P11.1 R70.2
NetR45_2: R45.2 U12.4(VO_ADJUST)

Not connected (* = marked no-connect by the designer): U12 3(NC)*

### Library data of the parts
C66-C68 C70 = CMP-1665-00015-4: as C97 on sheet SensorInAmp; PackageReference: Radial; ComponentLink2URL: http://industrial.panasonic.com/cdbs/www-data/pdf/RDF0000/ABA0000C1047.pdf; DatasheetVersion: 03/2016; REACH SVHC: No SVHC; Mounting Technology: Through Hole; ComponentLink2Description: Datasheet; Packaging: Bulk; Lead Pitch: 2.5 mm; Height: 11.2 mm; Pins: 2; RoHSCompliant: true; Mount: Through Hole; Package Quantity: 200; Min Operating Temperature: -40 degC; Max Operating Temperature: 85 degC; PackageDescription: 2-Pin Through Hole Device, Dia 6.3 mm, Body Length 11.2 mm; ComponentLink1Description: Manufacturer URL; Length: 11.2 mm; ComponentLink1URL: http://www.panasonic.com/
C69 = CMP-1037-04995-1: CAP 22uF 25V ±20% 1206 (3216 Metric) Thickness 1.9mm SMD; Case-EIA: 1206; Tolerance: Â±20%; Case-Metric: 3216; Rated Voltage: 25 V; Technology: SMT; Max Thickness: 1.9 mm; OrderURL: http://www.digikey.ie/product-detail/en/taiyo-yuden/TMK316BBJ226ML-T/587-3246-1-ND/3660105; Supplier Part Number 1: 587-3246-1-ND; Supplier 1: Digi-Key
C71 C72 = CMP-1036-04895-1: CAP 4.7uF 25V ±10% 0805 (2012 Metric) Thickness 1.45mm SMD; Case-Metric: 2012; Case-EIA: 0805; Tolerance: Â±10%; Technology: SMT; Rated Voltage: 25 V; Max Thickness: 1.45 mm
C99 = CMP-1037-04979-1: CAP 10uF 25V ±10% 1206 (3216 Metric) Thickness 1.9mm SMD; Case-EIA: 1206; Tolerance: Â±10%; Case-Metric: 3216; Rated Voltage: 25 V; Technology: SMT; Max Thickness: 1.9 mm; OrderURL: http://www.digikey.ie/product-detail/en/murata-electronics-north-america/GRM319R61E106KA12D/490-5525-1-ND/2334921; Supplier 1: Digi-Key; Supplier Part Number 1: 490-5525-1-ND
CH1 = 10uH 2.4A COMMON CHOKE: CMC 10UH 2.25A 2LN 9 KOHM SMD; Manufacturer: Wurth Electronics Inc.; Manufacturer Part Number: 744282100; Filter Type: Power, Signal Line; Number of Lines: 2; Impedance @ Frequency: 9 kOhm @ 100kHz; Inductance @ Frequency: 10µH @ 100kHz; DC Resistance (DCR) (Max): 50 mOhm; Voltage Rating - DC: 80V; Value: 1K; Published: 8-Jun-2000; LatestRevisionDate: 29-May-2009; LatestRevisionNote: IPC-7351 Footprint Added.; PackageReference: J1-0603; Publisher: Altium Limited; PackageDescription: Chip Resistor; RoHS: RoHS Compliant; Category: Filters; Packaging: Cut Tape (CT); Part Status: Active; Current Rating (Max): 2.25A; Voltage Rating - AC: -; Operating Temperature: -40°C ~ 125°C; Ratings: -; Approvals: -; Features: -; Mounting Type: Surface Mount; Size / Dimension: 0.492" L x 0.492" W (12.50mm x 12.50mm); Height (Max): 0.256" (6.50mm); Package / Case: Horizontal, 4 PC Pad; ComponentLink1URL: http://katalog.we-online.de/pbs/datasheet/744282100.pdf; ComponentLink1Description: http://katalog.we-online.de/pbs/datasheet/744282100.pdf; Supplier 1: Digi-Key; Supplier Part Number 1: 732-2966-1-ND; Stock 1: 0; Pricing 1: 1=3.82, 10=3.702, 50=3.3436, 100=3.2242, 250=2.9854 (EUR)
CH2 = 74477110: Manufacturer: Wurth Electronics Inc.; Material - Core: Ferrite; Inductance: 10µH; Tolerance: ±20%; Current - Saturation: 5.5A; Shielding: Shielded; DC Resistance (DCR): 25 mOhm Max; Frequency - Self Resonant: 21.5MHz; Frequency - Test: 1kHz; Value: 1K; Published: 8-Jun-2000; LatestRevisionDate: 29-May-2009; LatestRevisionNote: IPC-7351 Footprint Added.; PackageReference: J1-0603; Publisher: Altium Limited; PackageDescription: Chip Resistor; Manufacturer Part Number: 74477110; RoHS: RoHS Compliant; Category: Inductors, Coils, Chokes; Packaging: Cut Tape (CT); Part Status: Active; Type: Wirewound; Current Rating: 5A; Q @ Freq: -; Ratings: -; Operating Temperature: -40°C ~ 125°C; Mounting Type: Surface Mount; Package / Case: Nonstandard; Supplier Device Package: -; Size / Dimension: 0.472" L x 0.472" W (12.00mm x 12.00mm); Height - Seated (Max): 0.236" (6.00mm); ComponentLink1URL: http://katalog.we-online.de/pbs/datasheet/74477110.pdf; ComponentLink1Description: http://katalog.we-online.de/pbs/datasheet/74477110.pdf; Supplier 1: Digi-Key; Supplier Part Number 1: 732-1208-1-ND; Stock 1: 3817; Pricing 1: 1=2.82, 10=2.47, 50=2.2934, 100=2.2052, 250=2.11692 (EUR)
CONN1 = RAPC712X: Manufacturer: Switchcraft Inc.; Gender: Male; Industry Recognized Mating Diameter: 2.50mm ID (0.098"), 5.50mm OD (0.217"); Actual Diameter: 0.098" (2.50mm ID), 0.248" (6.30mm OD); Number of Positions/Contacts: 2 Conductors, 3 Contacts; Internal Switch(s): Single Switch, Normally Closed; Shielding: Unshielded; Current Rating: 5A; Includes: 1 pc - 1 Connector; Body Color: Black; Value: 1K; Published: 8-Jun-2000; LatestRevisionDate: 29-May-2009; LatestRevisionNote: IPC-7351 Footprint Added.; PackageReference: J1-0603; Publisher: Altium Limited; PackageDescription: Chip Resistor; Manufacturer Part Number: RAPC712X; RoHS: RoHS Compliant; Category: Connectors, Interconnects; Packaging: Bulk; Part Status: Active; Connector Type: Jack; Mounting Type: Through Hole, Right Angle; Mounting Feature: -; Termination: Solder Eyelet(s); Features: -; Insulation Color: -; Voltage - Rated: -; Mating Length/Depth: -; Contact Material - Plating: Silver; Body Material: -; Operating Temperature: -; Housing Material: Thermoplastic; Contact Material: Brass; Thread Size: -; Material Flammability Rating: -; Ingress Protection: -; ComponentLink1URL: http://www.switchcraft.com/Drawings/rapc712x_cd.pdf; ComponentLink1Description: http://www.switchcraft.com/Drawings/rapc712x_cd.pdf; Supplier 1: Digi-Key; Supplier Part Number 1: SC237-ND; Stock 1: 19155; Pricing 1: 1=0.85, 10=0.786, 25=0.7416, 50=0.719, 100=0.6852, 250=0.674, 500=0.6608 (EUR)
D5 = CMP-0860-00001-1: Surface Mount Zener Diode, 16 V, -65 to 125 degC, SOD123, RoHS, Tape and Reel; Manufacturer: Diodes Inc; Maximum Reverse Current: 0.1 uA; Tol V: 5.56% Typ.; Maximum Zener Impedance f: 1 kHz ZZK=200 Ohm; Voltage Zener: 16 V Typ.; Power Max: 500 mW; ComponentLink2URL: http://www.diodes.com/datasheets/ds18004.pdf; PackageDescription: 2-Pin SOD123, Body 2.7 x 1.55 mm, Height 1.45 mm; ComponentLink3Description: Package Specification; Mounting Technology: Surface Mount; PackageReference: SOD123; ComponentLink2Description: Datasheet; RoHS: TRUE; ComponentLink3URL: http://www.diodes.com/datasheets/ap02002.pdf; Operating Temperature: -65 to 150 degC; DatasheetVersion: Rev. 37-2; Packing: Tape and Reel; ComponentLink1Description: Manufacturer URL; ComponentLink1URL: http://www.diodes.com/; PackageVersion: Rev. 79; PartNumber: BZT52C16-7-F
F1 = TC RESETTBLE 2.0A 16V 1812: Manufacturer: Bel Fuse Inc.; Manufacturer Part Number: 0ZCG0200AF2B; Type: Polymeric; Current - Max: 100A; Current - Hold (Ih) (Max): 2A; Current - Trip (It): 3.5A; Time to Trip: 5s; Resistance - Initial (Ri) (Min): 20 mOhm; Resistance - Post Trip (R1) (Max): 85 mOhm; Approvals: cURus, TUV; Value: 1K; Published: 8-Jun-2000; LatestRevisionDate: 29-May-2009; LatestRevisionNote: IPC-7351 Footprint Added.; PackageReference: J1-0603; Publisher: Altium Limited; PackageDescription: Chip Resistor; RoHS: RoHS Compliant; Category: Circuit Protection; Packaging: Cut Tape (CT); Part Status: Active; Voltage - Max: 16V; Resistance - 25°C (Typ): -; Operating Temperature: -40°C ~ 85°C; Ratings: -; Mounting Type: Surface Mount; Package / Case: 1812 (4532 Metric), Concave; Size / Dimension: 0.179" L x 0.128" W (4.55mm x 3.24mm); Height - Seated (Max): -; Thickness (Max): 0.051" (1.30mm); Lead Spacing: -; ComponentLink1URL: http://www.belfuse.com/pdfs/0ZCG.pdf; ComponentLink1Description: http://www.belfuse.com/pdfs/0ZCG.pdf; Supplier 1: Digi-Key; Supplier Part Number 1: 507-2074-1-ND; Stock 1: 3479; Pricing 1: 1=0.24, 5=0.23, 10=0.221, 50=0.1972, 100=0.1835, 250=0.16312, 500=0.13594 (EUR)
M5 = MOSFET P-CH 60V 27A D2PAK: Manufacturer: Fairchild/ON Semiconductor; Manufacturer Part Number: FQB27P06TM; FET Type: P-Channel; Current - Continuous Drain (Id) @ 25°C: 27A (Tc); Drive Voltage (Max Rds On,  Min Rds On): 10V; Vgs(th) (Max) @ Id: 4V @ 250µA; Gate Charge (Qg) (Max) @ Vgs: 43nC @ 10V; Input Capacitance (Ciss) (Max) @ Vds: 1400pF @ 25V; Vgs (Max): ±25V; Power Dissipation (Max): 3.75W (Ta), 120W (Tc); Rds On (Max) @ Id, Vgs: 70 mOhm @ 13.5A, 10V; Value: 1K; Published: 8-Jun-2000; LatestRevisionDate: 29-May-2009; LatestRevisionNote: IPC-7351 Footprint Added.; PackageReference: J1-0603; Publisher: Altium Limited; PackageDescription: Chip Resistor; RoHS: RoHS Compliant; Category: Discrete Semiconductor Products; Packaging: Cut Tape (CT); Part Status: Active; Technology: MOSFET (Metal Oxide); Drain to Source Voltage (Vdss): 60V; FET Feature: -; Operating Temperature: -55°C ~ 175°C (TJ); Mounting Type: Surface Mount; Supplier Device Package: D²PAK (TO-263AB); Package / Case: TO-263-3, D²Pak (2 Leads + Tab), TO-263AB; ComponentLink1URL: https://www.fairchildsemi.com/datasheets/FQ/FQB27P06.pdf; ComponentLink1Description: https://www.fairchildsemi.com/datasheets/FQ/FQB27P06.pdf; Supplier 1: Digi-Key; Supplier Part Number 1: FQB27P06TMCT-ND; Stock 1: 4647; Pricing 1: 1=1.58, 10=1.406, 100=1.0959 (EUR)
P1 P11 = Header 2: Header, 2-Pin; Manufacturer: Molex, LLC; Manufacturer Part Number: 0901200122; Connector Type: Header, Breakaway; Pitch - Mating: 0.100" (2.54mm); Shrouding: Unshrouded; Number of Positions: 2; Number of Positions Loaded: All; Contact Length - Mating: 0.266" (6.75mm); LatestRevisionDate: 17-Jul-2002; LatestRevisionNote: Re-released for DXP Platform.; Publisher: Altium Limited; Supplier 1: Digi-Key; RoHS: RoHS Compliant; Category: Connectors, Interconnects; Stock 1: 16114; Pricing 1: 1=0.37, 10=0.358, 25=0.3064, 50=0.2604, 100=0.2502, 250=0.22468, 500=0.21448, 1000=0.17874 (EUR); Packaging: Bulk; Part Status: Active; Contact Type: Male Pin; Number of Rows: 1; Row Spacing - Mating: -; Mounting Type: Through Hole; Termination: Solder; Fastening Type: -; Features: -; Contact Finish - Mating: Tin; Contact Finish Thickness - Mating: 118.1µin (3.00µm); Insulation Color: Black; Ingress Protection: -; ComponentLink1URL: http://www.molex.com/pdm_docs/sd/901200122_sd.pdf; ComponentLink1Description: http://www.molex.com/pdm_docs/sd/901200122_sd.pdf
R44 = CMP-1012-00098-1: as R27 on sheet SensorInAmp; Technology: SMT; Tolerance: 5 %; Power: 0.1 W; OrderURL: http://www.digikey.ie/product-detail/en/yageo/RC0603JR-0710KL/311-10KGRCT-ND/729647; Supplier 1: Digi-Key; Supplier Part Number 1: 311-10KGRCT-ND
R45 = CMP-1012-00397-1: 100R 0.1W 1% 0603 (1608 Metric)  SMD; Case-EIA: 0603; Case-Metric: 1608; Technology: SMT; Tolerance: 1 %; Power: 0.1 W
R61 R70 = CMP-1012-00074-1: as R69 on sheet EmitterConnector; Technology: SMT; Tolerance: 5 %; Power: 0.1 W; OrderURL: http://www.digikey.ie/product-detail/en/yageo/RC0603JR-071KL/311-1.0KGRCT-ND/729624; Supplier 1: Digi-Key; Supplier Part Number 1: 311-1.0KGRCT-ND
SW1 = P227EE1CXC: SWITCH PUSHBUTTON DPST 7A 125V; Manufacturer: E-Switch; Switch Function: Off-On; Current Rating: 7A (AC); Actuator Type: Plunger for Cap; Color - Actuator/Cap: Blue; Electrical Life: 6,000 Cycles; Value: 1K; Published: 8-Jun-2000; LatestRevisionDate: 29-May-2009; LatestRevisionNote: IPC-7351 Footprint Added.; PackageReference: J1-0603; Publisher: Altium Limited; PackageDescription: Chip Resistor; Manufacturer Part Number: P227EE1CXC; RoHS: RoHS Compliant; Category: Switches; Packaging: Bulk; Part Status: Active; Type: Standard; Circuit: DPST; Voltage Rating - AC: 125V; Voltage Rating - DC: -; Illumination Type, Color: -; Illumination Voltage (Nominal): -; Mounting Type: Through Hole, Right Angle; Termination Style: PC Pin; Ingress Protection: -; Features: -; Panel Cutout Dimensions: -; Operating Temperature: -20°C ~ 85°C; Mechanical Life: -; ComponentLink1URL: http://media.digikey.com/pdf/Data%20Sheets/E-Switch%20PDFs/P227EE1CXC_Dwg.pdf; ComponentLink1Description: http://media.digikey.com/pdf/Data%20Sheets/E-Switch%20PDFs/P227EE1CXC_Dwg.pdf; Supplier 1: Digi-Key; Supplier Part Number 1: EG1026-ND; Stock 1: 1567; Pricing 1: 1=2.23, 10=2.076, 25=1.9768, 50=1.878, 100=1.8285, 250=1.77908, 500=1.68022, 1000=1.58139, 5000=1.3343 (EUR)
TP24-TP27 TP29 = Testpoint: as TP12 on sheet SensorInAmp; OrderURL: http://www.digikey.ie/product-detail/en/te-connectivity-amp-connectors/RCU-0C/A106145CT-ND/3477802; Value: *; Width: 0.8; Height: 1.15mm; Length: 1.60mm; Supplier Part Number 1: A106145CT-ND; Supplier 1: Digi-Key
U12 = CMP-0387-00611-2: 1.5 A, Wide Input, Non-Isolated, Wide Negative Output Adjust Module, -40 to 85 degC, 5-pin Module (EUS5), Pb-Free (RoHS); Manufacturer: Texas Instruments; VO Adjustable: TRUE; Vin(Max)(V): 29; Vout(Max)(V): -3; Regulated Outputs(#): 1; Iout(Max)(A): 1.5; SubFamily: Buck/Boost & Negative Output Module; Vout(Min)(V): -15; Vin(Min)(V): 7; ComponentLink4Description: URL Link1; PartNumber: PTN78000AAH; ComponentLink3URL: http://www.ti.com/litv/pdf/mpds139b; ComponentLink3Description: Package Specification; PackageDescription: 5-Pin Plastic Special Shape, Body 12.57 x 18.92 mm; PackageReference: EUS0005A; DatasheetVersion: SLTS246B; Mounting Technology: Through Hole; ComponentLink2URL: http://www.ti.com/general/docs/lit/getliterature.tsp?genericPartNumber=PTN78000A&fileType=pdf; Eco-Plan: Pb-Free (RoHS); ComponentLink2Description: Datasheet; ComponentLink1Description: Manufacturer URL; PackageVersion: 4204990-2/C; ComponentLink1URL: http://www.ti.com/; ComponentLink4URL: Samples URL:http://www.ti.com/product/ptn78000a#samples